# EAGLE design Grove - 12-bit Magnetic Rotary Position Sensor (AS5600) (EAGLE 9.6.2)
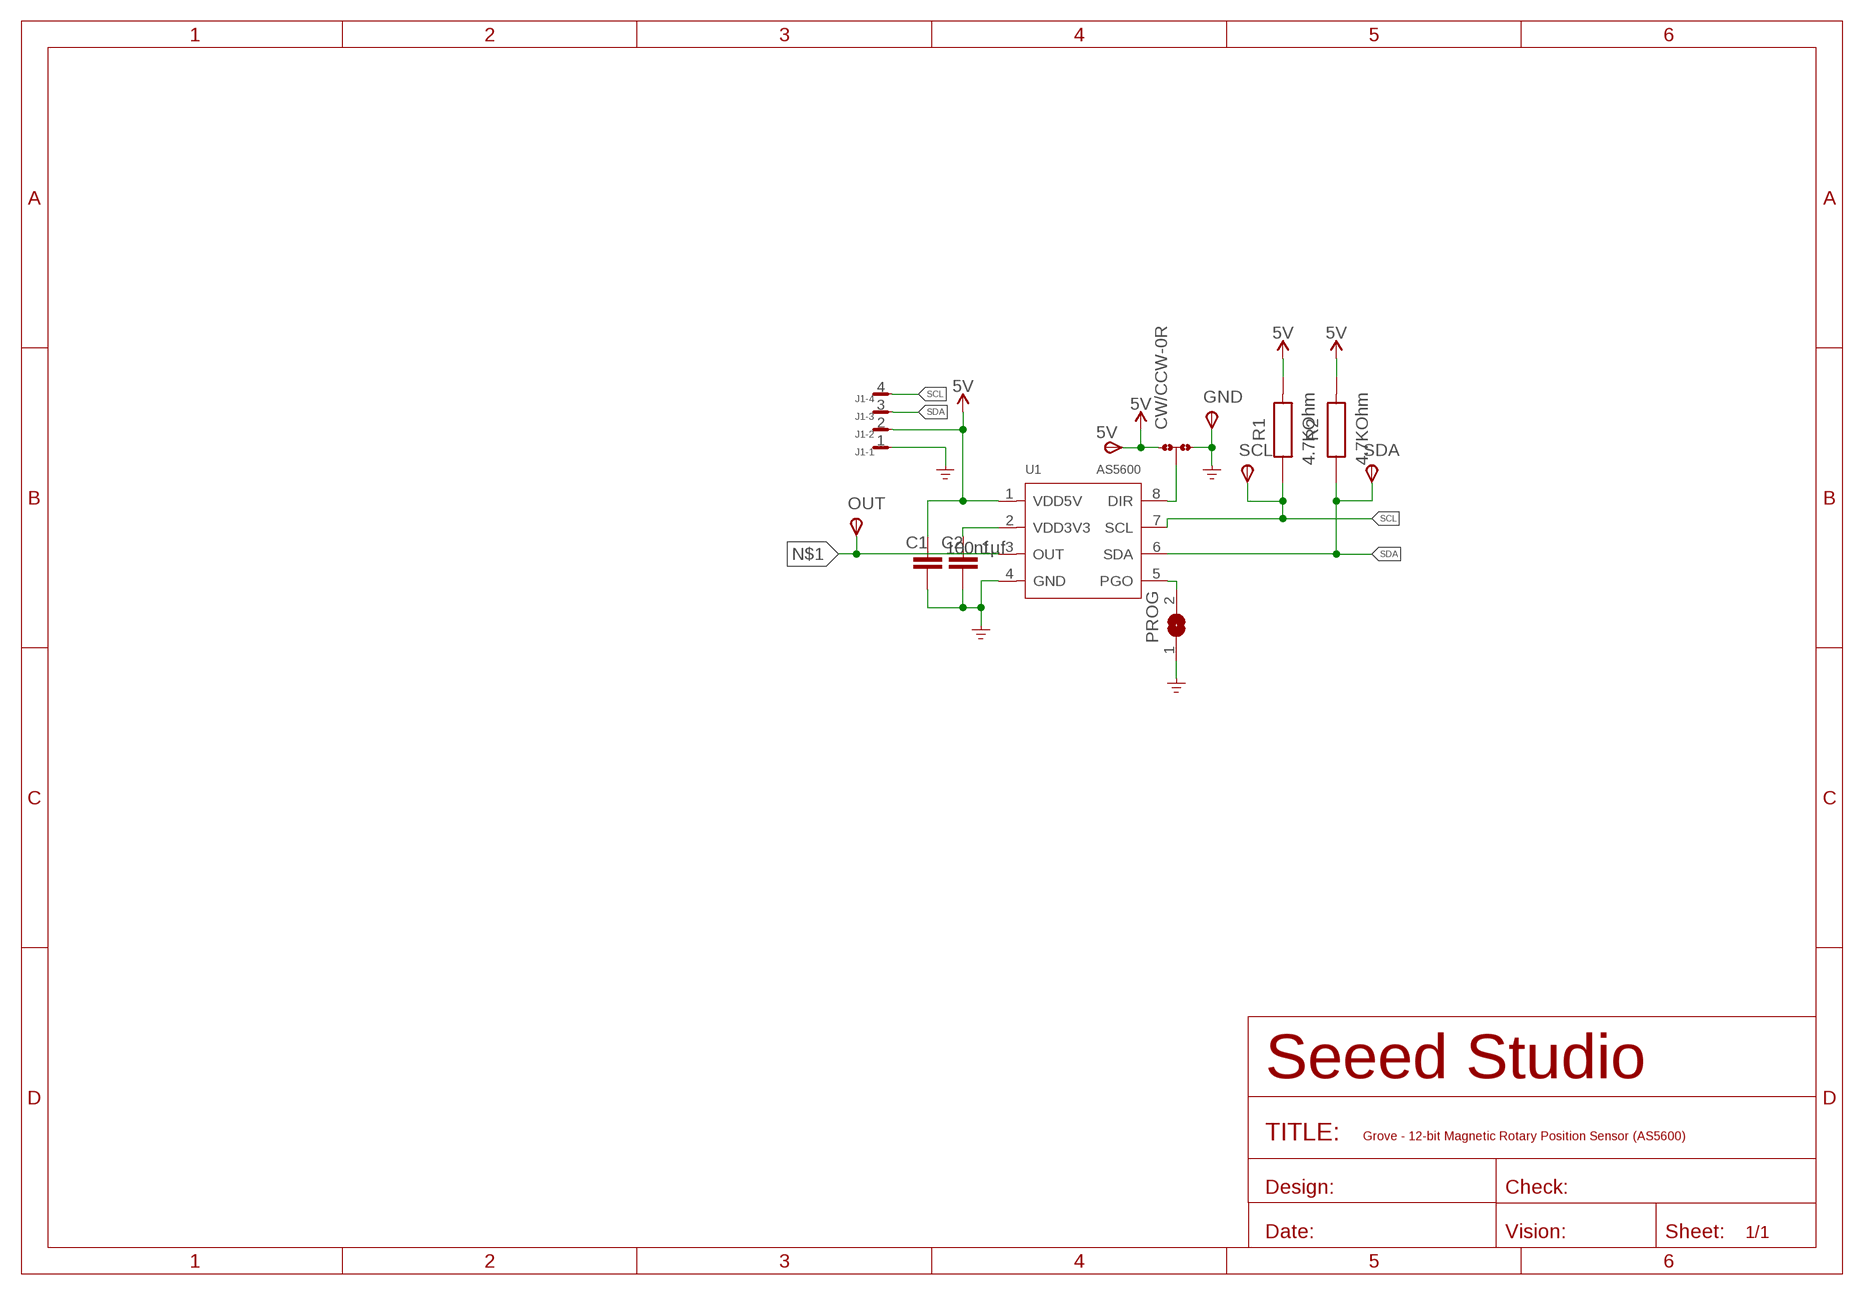
[diagram p0: schematic, sheet 1]

## Parts
5V  TPSB2,54  [B2,54]
C1  100nf  C_CHIP-0805(2012-METRIC)  [CAPC2012X110]
C2  1µf  C_CHIP-0805(2012-METRIC)  [CAPC2012X110]
CW/CCW  0R-JUMPA  [A0R-JMP]
GND  TPSB2,54  [B2,54]
J1  SM04B-SRSS-TB  [SM04B-SRSS-TB]
OUT  TPSB2,54  [B2,54]
PROG  SJ  [SJ]
R1  4.7KOhm  WRIS-KSKE_0805_560050320001_2.0X1.25X0.6  [WRIS-KSKE_0805_2.0X1.25X0.6(LXWXH)]
R2  4.7KOhm  WRIS-KSKE_0805_560050320001_2.0X1.25X0.6  [WRIS-KSKE_0805_2.0X1.25X0.6(LXWXH)]
SCL  TPSB2,54  [B2,54]
SDA  TPSB2,54  [B2,54]
U1  AS5600  SENSOR-AS5600  [SOIC8-1.27-5X4MM]

## Nets
5V: 5V.TP(PP) C1.1 CW/CCW.3 J1.2 R1.2 R2.2 U1.1(VDD5V)
GND: C1.2 C2.2 CW/CCW.1 GND.TP(PP) J1.1 PROG.1 U1.4(GND) ; supply symbol labelled GND_POWER
N$1: OUT.TP(PP) U1.3(OUT)
N$2: CW/CCW.2 U1.8(DIR)
N$3: C2.1 U1.2(VDD3V3)
N$5: PROG.2 U1.5(PGO)
SCL: J1.4 R1.1 SCL.TP(PP) U1.7(SCL)
SDA: J1.3 R2.1 SDA.TP(PP) U1.6(SDA)
Unconnected: J1.M1 J1.M2

## Library data of the parts
5V GND OUT SCL SDA = testpad:TPS: TEST PIN
C1 C2 = Capacitor:C: Capacitor - Generic; CATEGORY: Capacitor
CW/CCW = jump-0r-smd:0R-JUMP: SMD 0R 0805 Jumper
J1 = con-JST-SH:SM04B-SRSS-TB
PROG = jumper:SJ: SMD solder JUMPER
R1 R2 = Wurth_Resistor_WRIS-KSKE:WRIS-KSKE_0805: WRIS-KSKE Thick Film Resistors General Purpose Current Sensing Characteristics General purpose current sensing product series Mounting style: SMT-Chip (standard terminal) Resistance range: 50 mΩ ‒ 10 Ω Resistance tolerance: ±1 % Rated Power: 0.125 W ‒ 1 W TCR: ±100; +200; +250; +300 ppm/°C Operating temperature: -55 °C up to +155°C Sizes: 0402 / 0603 / 0805 / 1206 / 2010 / 2512 Recommended soldering: Reflow soldering Applications DC/DC converter Camera; night vision device Battery management for mobile phone Electric motor control Package name and Variant abbreviation: L X W X H =Length X Width X Height <https://katalog.we-online.com/media/images/v2/o135740v209%20Family_WRIS-KSKE.jpg> Details see: https://katalog.we-online.com/en/pbs/WRIS-KSKE Created by Ella Wu 2019-09-05 2019(C) Wurth Elektronik; DATASHEET-URL: https://katalog.we-online.de/pbs/datasheet/560050320001.pdf; IR: 1.81A; MOUNT: SMT; PART-NUMBER: 560050320001; PRATED: 0.33W; TCR: 250ppm/ °C; TECHNICAL-REFERENCE: KE0805R100F103LAATP0000; VALUE: 0.1Ohm
U1 = Sensor:SENSOR-AS5600

## Board
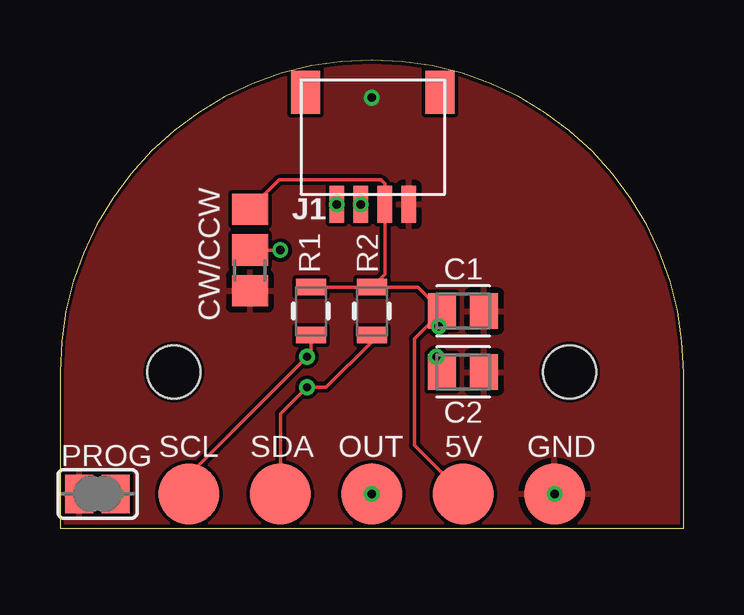
[diagram p1: board, top side]
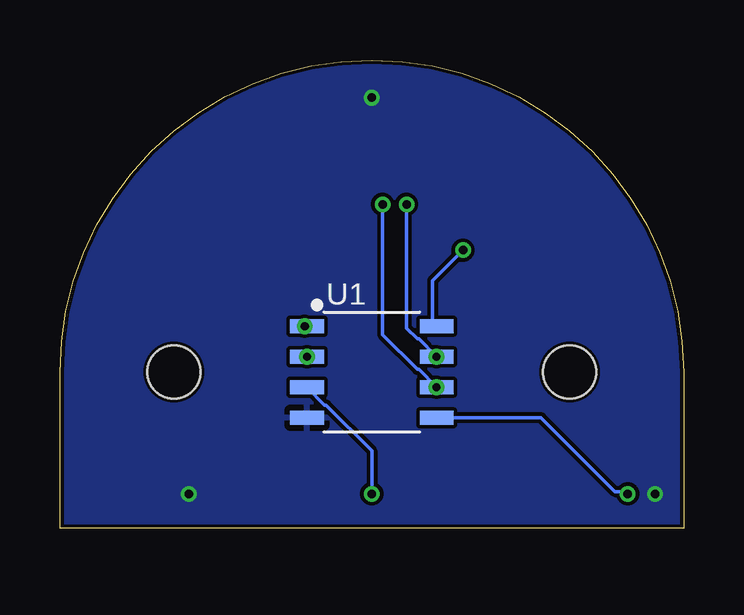
[diagram p2: board, bottom side, seen from below]

Size 26 x 19.5 mm. Coordinates in mm from the lower left corner, seen from the top.
Outline: 0,0 26,0 26,6.5 arc180 0,6.5 0,0
Copper layers (1*16): Top 0.035mm / dielectric 1.5mm / Bottom 0.035mm
Design rules "SparkFun-2-layer-PCBWay-LIMIT": minimum track width 6mil, minimum drill 0.3mm, track to track 6mil, track to pad 6mil, pad to pad 6mil, via to via 6mil, smd to smd 6mil, copper to edge 6mil, drill to drill 6mil, minimum pad ring 6mil, minimum via ring 6mil, stop-mask expansion 4mil, vias tented up to drill 25mil, thermal gap 10mil
Holes 2.2 mm at 4.75,6.5 21.25,6.5

### Footprints (pad centres in the part's own frame; a part is rotated, then mirrored left to right if it is on the bottom)
B2,54 = smd 2.54 x 2.54: TP 0,0
CAPC2012X110 = smd 1.165 x 1.465: 1 -0.875,0; 2 0.875,0
A0R-JMP = smd 1.5 x 1.3: 1 0,1.7; 2 0,0; 3 0,-1.7
SM04B-SRSS-TB = smd 0.6 x 1.55: 1 -2,4.675; 2 -1,4.675; 3 0,4.675; 4 1,4.675 | smd 1.2 x 1.8: M1 2.3,0; M2 -3.3,0
SJ = smd 1.168 x 1.6: 1 -0.762,0; 2 0.762,0
WRIS-KSKE_0805_2.0X1.25X0.6(LXWXH) = smd 0.7 x 1.25: 1 -1,0; 2 1,0
SOIC8-1.27-5X4MM = smd 0.6 x 1.4: 1 -1.905,-2.7; 2 -0.635,-2.7; 3 0.635,-2.7; 4 1.905,-2.7; 5 1.905,2.7; 6 0.635,2.7; 7 -0.635,2.7; 8 -1.905,2.7

### Placement (x,y rotation side)
5V  16.81,1.42 0 top
C1  16.81,9.04 0 top
C2  16.81,6.5 0 top
CW/CCW  7.92,11.58 180 top
GND  20.62,1.42 0 top
J1  12.54,18.16 180 top
OUT  13,1.42 0 top
PROG  1.57,1.42 0 top
R1  10.46,9.04 90 top
R2  13,9.04 90 top
SCL  5.38,1.42 0 top
SDA  9.19,1.42 0 top
U1  13,6.5 270 bottom

### Tracks (layer width: path | path; a pad name or v marks a point on that pad's centre or on a via)
5V  (via drill 0.35)
  Top 0.152: R2.2 13.54,10.58 J1.2 13.54,14.34 13.38,14.5 9.14,14.5 CW/CCW.3 | C1.1 14.94,10.04 R2.2 | R1.2 R2.2 | C1.1 14.78,7.88 14.78,3.45 5V.TP | C1.1 15.94,8.55 v15.79,8.4
  Bottom 0.152: U1.1 v15.79,8.4
GND  (via drill 0.35)
  other vias: 1.19,1.42 20.62,1.42 13,17.93
  pour Top: -0.97,-1.12 -0.97,20.47 26.97,20.47 26.97,-1.12
  pour Bottom: -2.24,-2.39 -2.24,21.74 28.24,21.74 28.24,-2.39
N$1  (via drill 0.35)
  Bottom 0.152: U1.3 14.96,5.12 14.9,5.12 13,3.22 OUT.TP
  other vias: 13,1.42
N$2  (via drill 0.35)
  Top 0.152: CW/CCW.2 v9.19,11.58
  Bottom 0.152: v9.19,11.58 10.46,10.31 10.46,8.56 U1.8
N$3  (via drill 0.35)
  Top 0.152: C2.1 15.7,6.74 U1.2
  other vias: 15.7,7.13
N$5  (via drill 0.35)
  Bottom 0.152: PROG.2 2.43,1.51 2.86,1.51 5.95,4.59 U1.5
  other vias: 2.33,1.42
SCL  (via drill 0.35)
  Top 0.152: R1.1 10.46,7.26 10.33,7.13 U1.7 5.38,2.21 SCL.TP
  Bottom 0.152: U1.7 11.04,7.88 11.1,7.88 11.54,8.32 J1.4
  other vias: 10.3,7.13 11.54,13.48
SDA  (via drill 0.35)
  Top 0.152: R2.1 13,7.77 11.1,5.87 U1.6 9.19,4.75 SDA.TP
  Bottom 0.152: U1.6 11.04,6.61 11.1,6.61 12.54,8.05 J1.3
  other vias: 10.3,5.87 12.54,13.48